# Altium schematic sheet PadaukPMS171BTestBoard.SchDoc
size A4; SheetNumber: 1; SheetTotal: 1
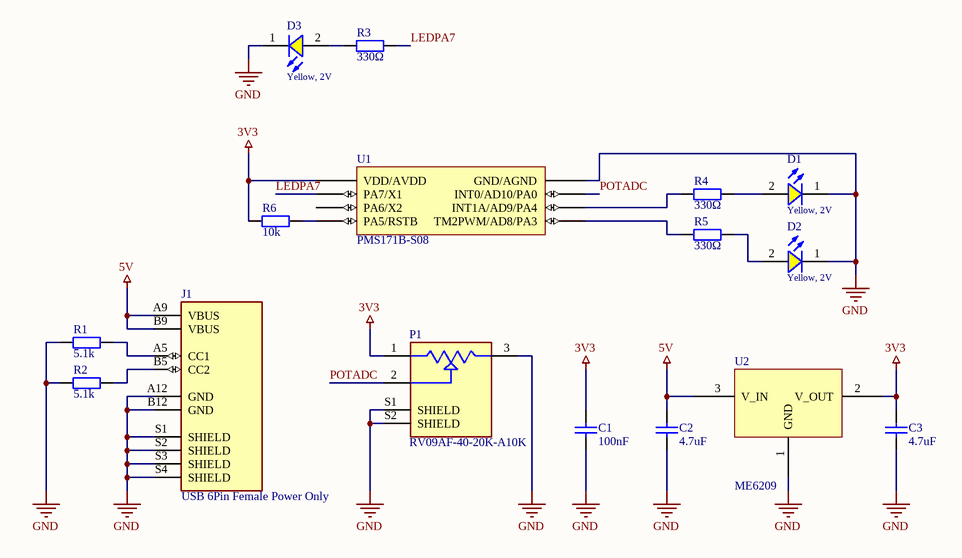
[diagram p0: PadaukPMS171BTestBoard.SchDoc]

## Parts
C1  100nF  [WCAP-CSGP_0805_H=0.8mm_Reflow]
C2  4.7uF  [WCAP-CSGP_0805_H=0.8mm_Reflow]
C3  4.7uF  [WCAP-CSGP_0805_H=0.8mm_Reflow]
D1  Yellow, 2V  [WL-SMCW_0603_H=0.7mm]
D2  Yellow, 2V  [WL-SMCW_0603_H=0.7mm]
D3  Yellow, 2V  [WL-SMCW_0603_H=0.7mm]
J1  USB 6Pin Female Power Only  [GCT_USB4125-GF-A_REVA2]
P1  RV09AF-40-20K-A10K  [PTV09A-4025F-B103]
R1  5.1k  [WRIS-PSMB_0805_H=0.22mm]
R2  5.1k  [WRIS-PSMB_0805_H=0.22mm]
R3  330Ω  [WRIS-PSMB_0805_H=0.22mm]
R4  330Ω  [WRIS-PSMB_0805_H=0.22mm]
R5  330Ω  [WRIS-PSMB_0805_H=0.22mm]
R6  10k  [WRIS-PSMB_0805_H=0.22mm]
U1  PMS171B-S08  [PMS171B-S08]
U2  ME6209  [SOT95P285X150-3N]

## Nets
3V3: C1.2 C3.2 P1.1 R6.1 U1.1(VDD/AVDD) U2.2(V_OUT)
5V: C2.2 J1.A9(VBUS) J1.B9(VBUS) U2.3(V_IN)
GND: C1.1 C2.1 C3.1 D1.1(K) D2.1(K) D3.1(K) J1.A12(GND) J1.B12(GND) J1.S1(SHIELD) J1.S2(SHIELD) J1.S3(SHIELD) J1.S4(SHIELD) P1.3 P1.S1(SHIELD) P1.S2(SHIELD) R1.1 R2.1 U1.8(GND/AGND) U2.1(GND)
LEDPA7: R3.1 U1.2(PA7/X1)
POTADC: P1.2 U1.7(INT0/AD10/PA0)
NetD1_2: D1.2(A) R4.1
NetD2_2: D2.2(A) R5.1
NetD3_2: D3.2(A) R3.2
NetJ1_A5: J1.A5(CC1) R1.2
NetJ1_B5: J1.B5(CC2) R2.2
NetR4_2: R4.2 U1.6(INT1A/AD9/PA4)
NetR5_2: R5.2 U1.5(TM2PWM/AD8/PA3)
NetR6_2: R6.2 U1.4(PA5/RSTB)

Not connected (* = marked no-connect by the designer): U1 3(PA6/X2)

## Library data of the parts
C1-C3 = 885012007021: WCAP-CSGP General Purpose Ceramic Capacitors, size 0805, 1nF, +/-5%, 16VDC; Isolation Resistance: >=10GOhm; Ceramic Type: NP0; Dissipation Factor: Q>=1000; Technical Reference: NP00805102J016DFCT10000; ComponentLink1Description: Manufacturer; ComponentLink1URL: http://www.we-online.de; ComponentLink2Description: Datasheet; ComponentLink2URL: https://katalog.we-online.com/pbs/datasheet/885012007021.pdf; Operating Temperature: -55 to +125degC; Packaging: Tape and Reel; Part Number: 885012007021; Publisher: Wurth Elektronik; Rated Voltage: 16VDC; Published Date: August 2019; Capacitance Tolerance: +/-5%; Height: 0.8mm +/-0.10mm; Mounting Technology: SMD; Size: 0805; Capacitance: 1nF
D1-D3 = 150060YS75000: WL-SMCW SMT Mono-color Chip LED Waterclear, size 0603, Yellow, 2V, 140deg; Chip Technology: AlInGaP; Dominant Wavelength typ.: 590nm; Luminous Intensity typ.: 120mcd; Peak Wavelength typ.: 595nm; Viewing Angle: 140deg; ComponentLink1Description: Manufacturer; ComponentLink1URL: http://www.we-online.de; ComponentLink2URL: https://www.we-online.com/catalog/datasheet/150060YS75000.pdf; ComponentLink2Description: Datasheet; Forward Voltage typ.: 2V; Emitting Color: Yellow; Mounting Technology: SMT; Operating Temperature: -40 to +85degC; Published Date: December 2019; Part Number: 150060YS75000; Packaging: Tape and Reel; Size: 0603; Publisher: Wurth Elektronik
J1 = USB4125-GF-A_REVA2: Package: None; Availability: Unavailable; MP: USB4125-GF-A_REVA2; Value: *; Price: None
P1 = RV09AF-40-20K-A10K: PC Mount Black Shaft Potentiometers Audio 9mm 10K; MF: Alpha Taiwan; SnapEDA_Link: https://www.snapeda.com/parts/RV09AF-40-20K-A10K/Alpha/view-part/?ref=snap; Package: None; Value: *; MP: RV09AF-40-20K-A10K; Check_prices: https://www.snapeda.com/parts/RV09AF-40-20K-A10K/Alpha/view-part/?ref=eda
R1-R6 = 580060720008: WRIS-PSMB Metal Plate Resistors, size 0805, 10mOhm, +/-1%, 0.5W; Rated Current: 7.07A; Temperature Coefficient of Resistance: +/-100ppm/degC; Technical Reference: MB0805R010F102KAATP0000; ComponentLink1Description: Manufacturer; ComponentLink1URL: http://www.we-online.de; ComponentLink2Description: Datasheet; ComponentLink2URL: https://katalog.we-online.com/pbs/datasheet/580060720008.pdf; Publisher: Wurth Elektronik; Rated Power: 0.5W; Resistance: 10mOhm; Mounting Technology: SMT; Height: 0.22mm; Part Number: 580060720008; Packaging: Tape and Reel; Published Date: September 2019; Size: 0805; Length: 2mm; Operating Temperature: -55 to +155degC; Resistance Tolerance: +/-1%; Width: 1.25mm